# EAGLE design lm78xx vreg (EAGLE 7.2.0)
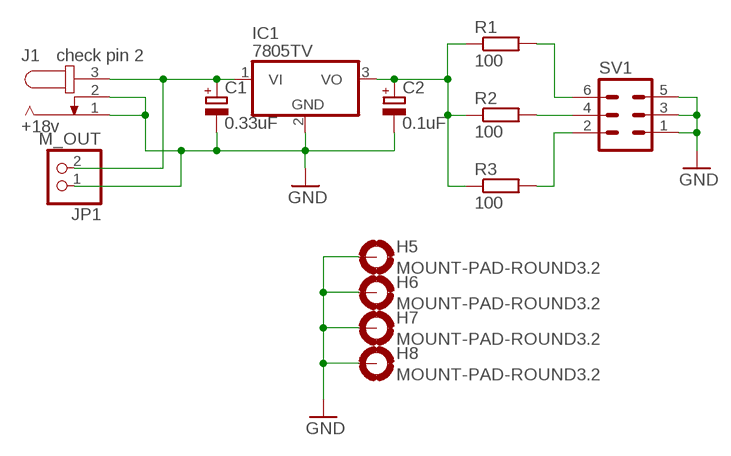
[diagram p0: schematic, sheet 1]

## Parts
C1  0.33uF  CPOL-EUE2.5-7  [E2,5-7]
C2  0.1uF  CPOL-EUE2.5-7  [E2,5-7]
H5  MOUNT-PAD-ROUND3.2  [3,2-PAD]
H6  MOUNT-PAD-ROUND3.2  [3,2-PAD]
H7  MOUNT-PAD-ROUND3.2  [3,2-PAD]
H8  MOUNT-PAD-ROUND3.2  [3,2-PAD]
IC1  7805TV  [TO220V]
J1  +18v  JACK-PLUG1  [SPC4078]
JP1  M_OUT  PINHD-1X2  [1X02]
R1  100  R-EU_R0805W  [R0805W]
R2  100  R-EU_R0805W  [R0805W]
R3  100  R-EU_R0805W  [R0805W]
SV1  MA03-2  [MA03-2]

## Nets
GND: C1.- C2.- H5.B3,2(MOUNT) H6.B3,2(MOUNT) H7.B3,2(MOUNT) H8.B3,2(MOUNT) IC1.2(GND) J1.1 J1.2 JP1.1 SV1.1 SV1.3 SV1.5
N$1: C1.+ IC1.1(VI) J1.3 JP1.2
N$2: C2.+ IC1.3(VO) R1.1 R2.1 R3.1
N$3: R2.2 SV1.4
N$4: R1.2 SV1.6
N$5: R3.2 SV1.2

## Notes on the sheet
- check pin 2

## Library data of the parts
C1 C2 = rcl:CPOL-EU: POLARIZED CAPACITOR, European symbol
H5-H8 = holes:MOUNT-PAD-ROUND: MOUNTING PAD, round
IC1 = linear:78*: Positive VOLTAGE REGULATOR Source: http://cache.national.com/ds/LM/LM78L05.pdf http://www.fairchildsemi.com/ds/LM/LM7805.pdf
J1 = con-jack:JACK-PLUG: DC POWER JACK Power Jack, DC, Right Angle, Through Hole, Rated 5A at 16VDC, PC Terminals Distributor: Farnell (www.Farnell.de) Drawing: 84N1161.pdf / 84N1162.pdf Manufacturer: SPC Technology (www.spctechnology.com) Type: SPC4077 / SPC 4078; OC_FARNELL: unknown; OC_NEWARK: unknown
JP1 = pinhead:PINHD-1X2: PIN HEADER
R1-R3 = rcl:R-EU_: RESISTOR, European symbol
SV1 = con-lstb:MA03-2: PIN HEADER; OC_FARNELL: unknown; OC_NEWARK: unknown

## Board
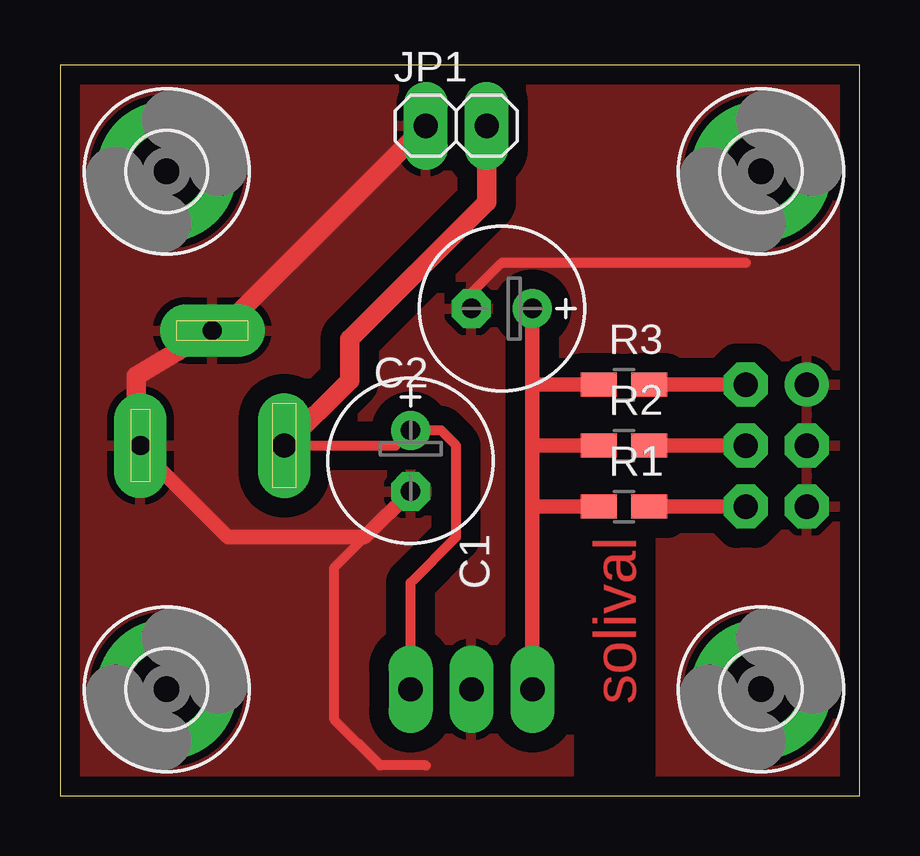
[diagram p1: board, top side]
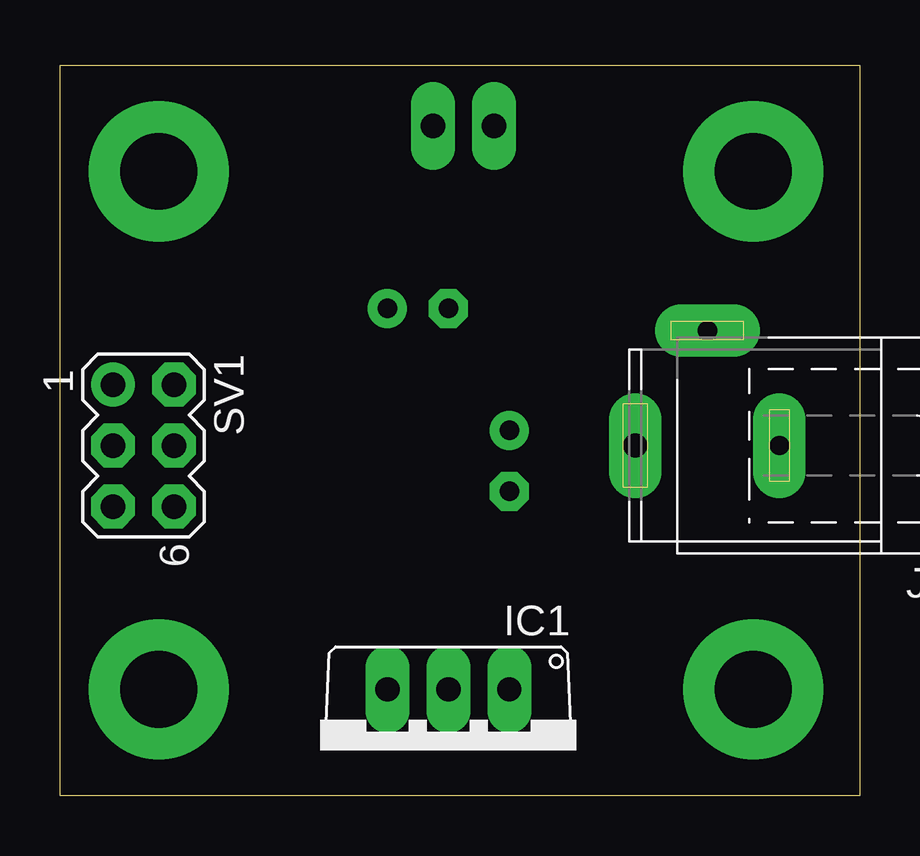
[diagram p2: board, bottom side, seen from below]

Size 33.33 x 30.47 mm. Coordinates in mm from the lower left corner, seen from the top.
Outline: 0,0 33.33,0 33.33,30.47 0,30.47 0,0
Copper layers (1*16): Top 0.035mm / dielectric 1.5mm / Bottom 0.035mm
Design rules "homephotoresist": minimum track width 12mil, minimum drill 16mil, track to track 12mil, track to pad 12mil, pad to pad 12mil, via to via 12mil, smd to smd 0mil, copper to edge 20mil, drill to drill 20mil, minimum pad ring 16mil, minimum via ring 20mil, stop-mask expansion 4mil, vias tented up to drill 0mil, thermal gap 12mil

### Footprints (pad centres in the part's own frame; a part is rotated, then mirrored left to right if it is on the bottom)
E2,5-7 = drill 0.813 pad 1.6: + -1.27,0 | drill 0.813 pad 1.6 octagon: - 1.27,0
3,2-PAD = drill 3.2 pad 5.842: B3,2 0,0
TO220V = drill 1.016 long: 1 -2.54,-2.54; 2 0,-2.54; 3 2.54,-2.54
SPC4078 = drill 0.8 pad 2.184 long: 1 -3,0; 2 0,-4.8 | drill 1 pad 2.184 long: 3 3,0
1X02 = drill 1.016 long: 1 -1.27,0; 2 1.27,0
R0805W = smd 1.5 x 1: 1 -1.052,0; 2 1.052,0
MA03-2 = drill 1.016: 1 -2.54,-1.27 | drill 1.016 octagon: 2 -2.54,1.27; 3 0,-1.27; 4 0,1.27; 5 2.54,-1.27; 6 2.54,1.27

### Placement (x,y rotation side)
C1  14.61,13.97 270 top
C2  18.41,20.32 180 top
H5  4.45,26.04 0 top
H6  29.21,26.04 0 top
H7  29.21,4.45 0 top
H8  4.45,4.45 0 top
IC1  17.14,1.91 180 bottom
J1  6.35,14.61 180 bottom
JP1  16.51,27.94 0 top
R1  23.49,12.06 0 top
R2  23.49,14.61 0 top
R3  23.49,17.14 0 top
SV1  29.84,14.61 270 bottom

### Tracks (layer width: path | path; a pad name or v marks a point on that pad's centre or on a via)
GND
  Top 0.406: IC1.2 17.14,3.17 | 15.24,1.27 13.34,1.27 11.43,3.17 11.43,9.53 C1.- | C2.- 17.14,20.95 18.41,22.23 28.57,22.23
  Top 0.61: 3.17,14.61 6.99,10.79 12.7,10.79 C1.-
  Top 0.813: 3.17,14.61 3.17,17.5 J1.2 6.71,19.41 JP1.1
  pour Top (isolate 0.813): -0.64,31.11 34.29,31.11 34.29,-0.64 -0.64,-0.64
N$1
  Top 0.406: IC1.1 14.61,8.89 16.51,10.79 16.51,14.61 15.88,15.24 C1.+ 13.97,14.61 J1.3
  Top 0.813: J1.3 12.06,17.32 12.06,19.05 17.78,24.77 JP1.2
N$2
  Top 0.61: IC1.3 19.68,12.06 | 19.68,12.06 19.68,14.61 | 19.68,14.61 19.68,17.14 | 19.68,17.14 C2.+ | R1.1 19.68,12.06 | R2.1 19.68,14.61 | R3.1 19.68,17.14
N$3
  Top 0.61: SV1.4 R2.2
N$4
  Top 0.61: SV1.6 R1.2
N$5
  Top 0.61: SV1.2 R3.2

### Text on the board
Top: solival